# Altium schematic sheet MCU.SchDoc
size A; SheetNumber: 2; SheetTotal: 3
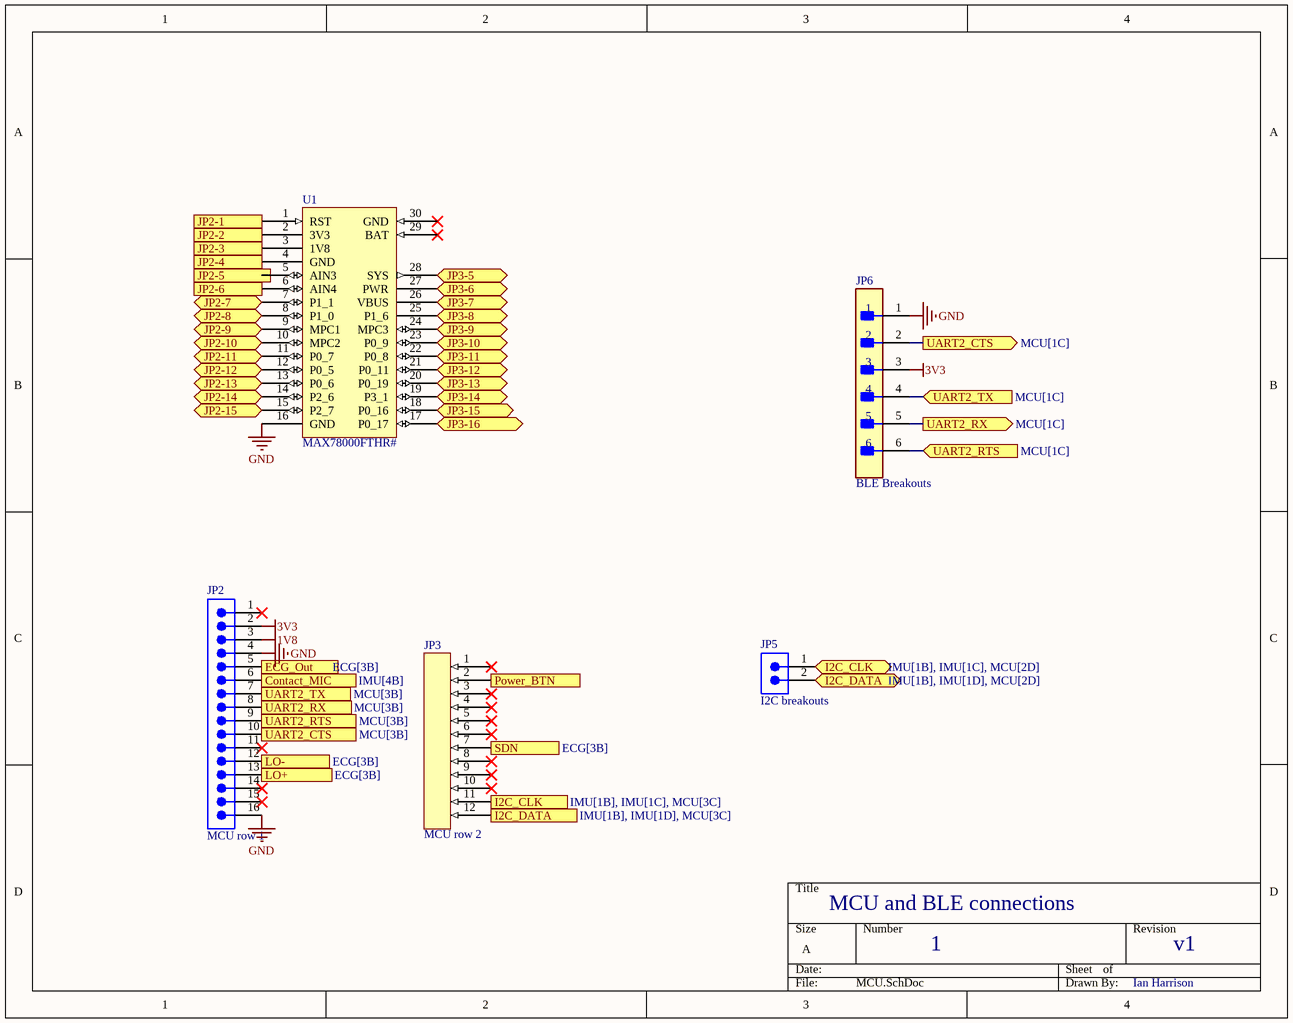
[diagram p0: MCU.SchDoc]

## Parts
JP2  MCU row 1  [SMTC-TSW-116-08-X-S]
JP3  MCU row 2  [New footprint 1]
JP5  I2C breakouts  [61300211121]
JP6  BLE Breakouts  [FP-22-28-4060-MFG]
U1  MAX78000FTHR#  (graphical)

## Ports
Contact_MIC (in, see IMU[4B]), ECG_Out (in, see ECG[3B]), I2C_CLK (bidir, see IMU[1B], IMU[1C], MCU[2D]), I2C_CLK (in, see IMU[1B], IMU[1C], MCU[3C]), I2C_DATA (bidir, see IMU[1B], IMU[1D], MCU[2D]), I2C_DATA (in, see IMU[1B], IMU[1D], MCU[3C]), JP2-1 (in), JP2-2, JP2-3, JP2-4, JP2-5 (in), JP2-6 (in), JP2-7 (bidir), JP2-8 (bidir), JP2-9 (bidir), JP2-10 (bidir), JP2-11 (bidir), JP2-12 (bidir), JP2-13 (bidir), JP2-14 (bidir), JP2-15 (bidir), JP3-5 (bidir), JP3-6 (bidir), JP3-7 (bidir), JP3-8 (bidir), JP3-9 (bidir), JP3-10 (bidir), JP3-11 (bidir), JP3-12 (bidir), JP3-13 (bidir), JP3-14 (bidir), JP3-15 (bidir), JP3-16 (bidir), LO+ (in, see ECG[3B]), LO- (in, see ECG[3B]), Power_BTN (in), SDN (out, see ECG[3B]), UART2_CTS (in, see MCU[3B]), UART2_CTS (out, see MCU[1C]), UART2_RTS (in, see MCU[1C]), UART2_RTS (out, see MCU[3B]), UART2_RX (in, see MCU[3B]), UART2_RX (out, see MCU[1C]), UART2_TX (in, see MCU[1C]), UART2_TX (out, see MCU[3B])

## Nets
1V8: JP2.3
3V3: JP2.2 JP6.3
GND: JP2.4 JP2.16 JP6.1 U1.16(GND)
Contact_MIC: JP2.6 ; port Contact_MIC
ECG_Out: JP2.5 ; port ECG_Out
I2C_CLK: JP3.11 JP5.1 ; port I2C_CLK
I2C_DATA: JP3.12 JP5.2 ; port I2C_DATA
JP2-1: U1.1(RST) ; port JP2-1
JP2-2: U1.2(3V3) ; port JP2-2
JP2-3: U1.3(1V8) ; port JP2-3
JP2-4: U1.4(GND) ; port JP2-4
JP2-6: U1.6(AIN4) ; port JP2-6
JP2-7: U1.7(P1_1) ; port JP2-7
JP2-8: U1.8(P1_0) ; port JP2-8
JP2-9: U1.9(MPC1) ; port JP2-9
JP2-10: U1.10(MPC2) ; port JP2-10
JP2-11: U1.11(P0_7) ; port JP2-11
JP2-12: U1.12(P0_5) ; port JP2-12
JP2-13: U1.13(P0_6) ; port JP2-13
JP2-14: U1.14(P2_6) ; port JP2-14
JP2-15: U1.15(P2_7) ; port JP2-15
JP3-5: U1.28(SYS) ; port JP3-5
JP3-6: U1.27(PWR) ; port JP3-6
JP3-7: U1.26(VBUS) ; port JP3-7
JP3-8: U1.25(P1_6) ; port JP3-8
JP3-9: U1.24(MPC3) ; port JP3-9
JP3-10: U1.23(P0_9) ; port JP3-10
JP3-11: U1.22(P0_8) ; port JP3-11
JP3-12: U1.21(P0_11) ; port JP3-12
JP3-13: U1.20(P0_19) ; port JP3-13
JP3-14: U1.19(P3_1) ; port JP3-14
JP3-15: U1.18(P0_16) ; port JP3-15
JP3-16: U1.17(P0_17) ; port JP3-16
LO+: JP2.13 ; port LO+
LO-: JP2.12 ; port LO-
Power_BTN: JP3.2 ; port Power_BTN
SDN: JP3.7 ; port SDN
UART2_CTS: JP2.10 JP6.2 ; port UART2_CTS
UART2_RTS: JP2.9 JP6.6 ; port UART2_RTS
UART2_RX: JP2.8 JP6.5 ; port UART2_RX
UART2_TX: JP2.7 JP6.4 ; port UART2_TX

Not connected (* = marked no-connect by the designer): JP2 1* 11* 14* 15*; JP3 1* 3* 4* 5* 6* 8* 9* 10*; U1 5(AIN3) 29(BAT)* 30(GND)*

## Notes on the sheet
- MCU and BLE connections
- 1
- v1
- Ian Harrison

## Library data of the parts
JP2 = CMP-002-00076-1: Board Connector, 16 Contact(s), 1 Row(s), Male, Straight, 0.1 inch Pitch, Solder Terminal, Black Insulator; RoHS Compliant: Yes; Connector Type: BOARD CONNECTOR; Mounting Technology: Board
JP3 = CMP-002-00080-1: 12 pin header male .1 pitch
JP5 = CMP-002-00074-2: Board Connector, 2 Contact(s), 1 Row(s), Male, Straight, 0.1 inch Pitch, Solder Terminal, Locking, Black Insulator, Plug; Mounting Technology: Board; Connector Type: BOARD CONNECTOR; Max Operating Temperature: 125°C; Min Operating Temperature: -40°C; RoHS Compliant: Yes
JP6 = CMP-002-00075-1: Board Connector, 6 Contact(s), 1 Row(s), Male, Straight, 0.1 inch Pitch, Solder Terminal, Locking, Black Insulator, Receptacle; RoHS Compliant: Yes; Connector Type: BOARD CONNECTOR; Mounting Technology: Board
U1 = CMP-020-00023-3: MAX78000 1000KBytes Flash Ultra-Low-Power Arm Cortex-M4 Processor Evaluation Board; Clock Frequency: 100MHz; RoHS Compliant: No